# EAGLE schematic EEZ DIB v1.2 module dimensions (EAGLE 7.2.0)
Assembly variants: Farnell, TME
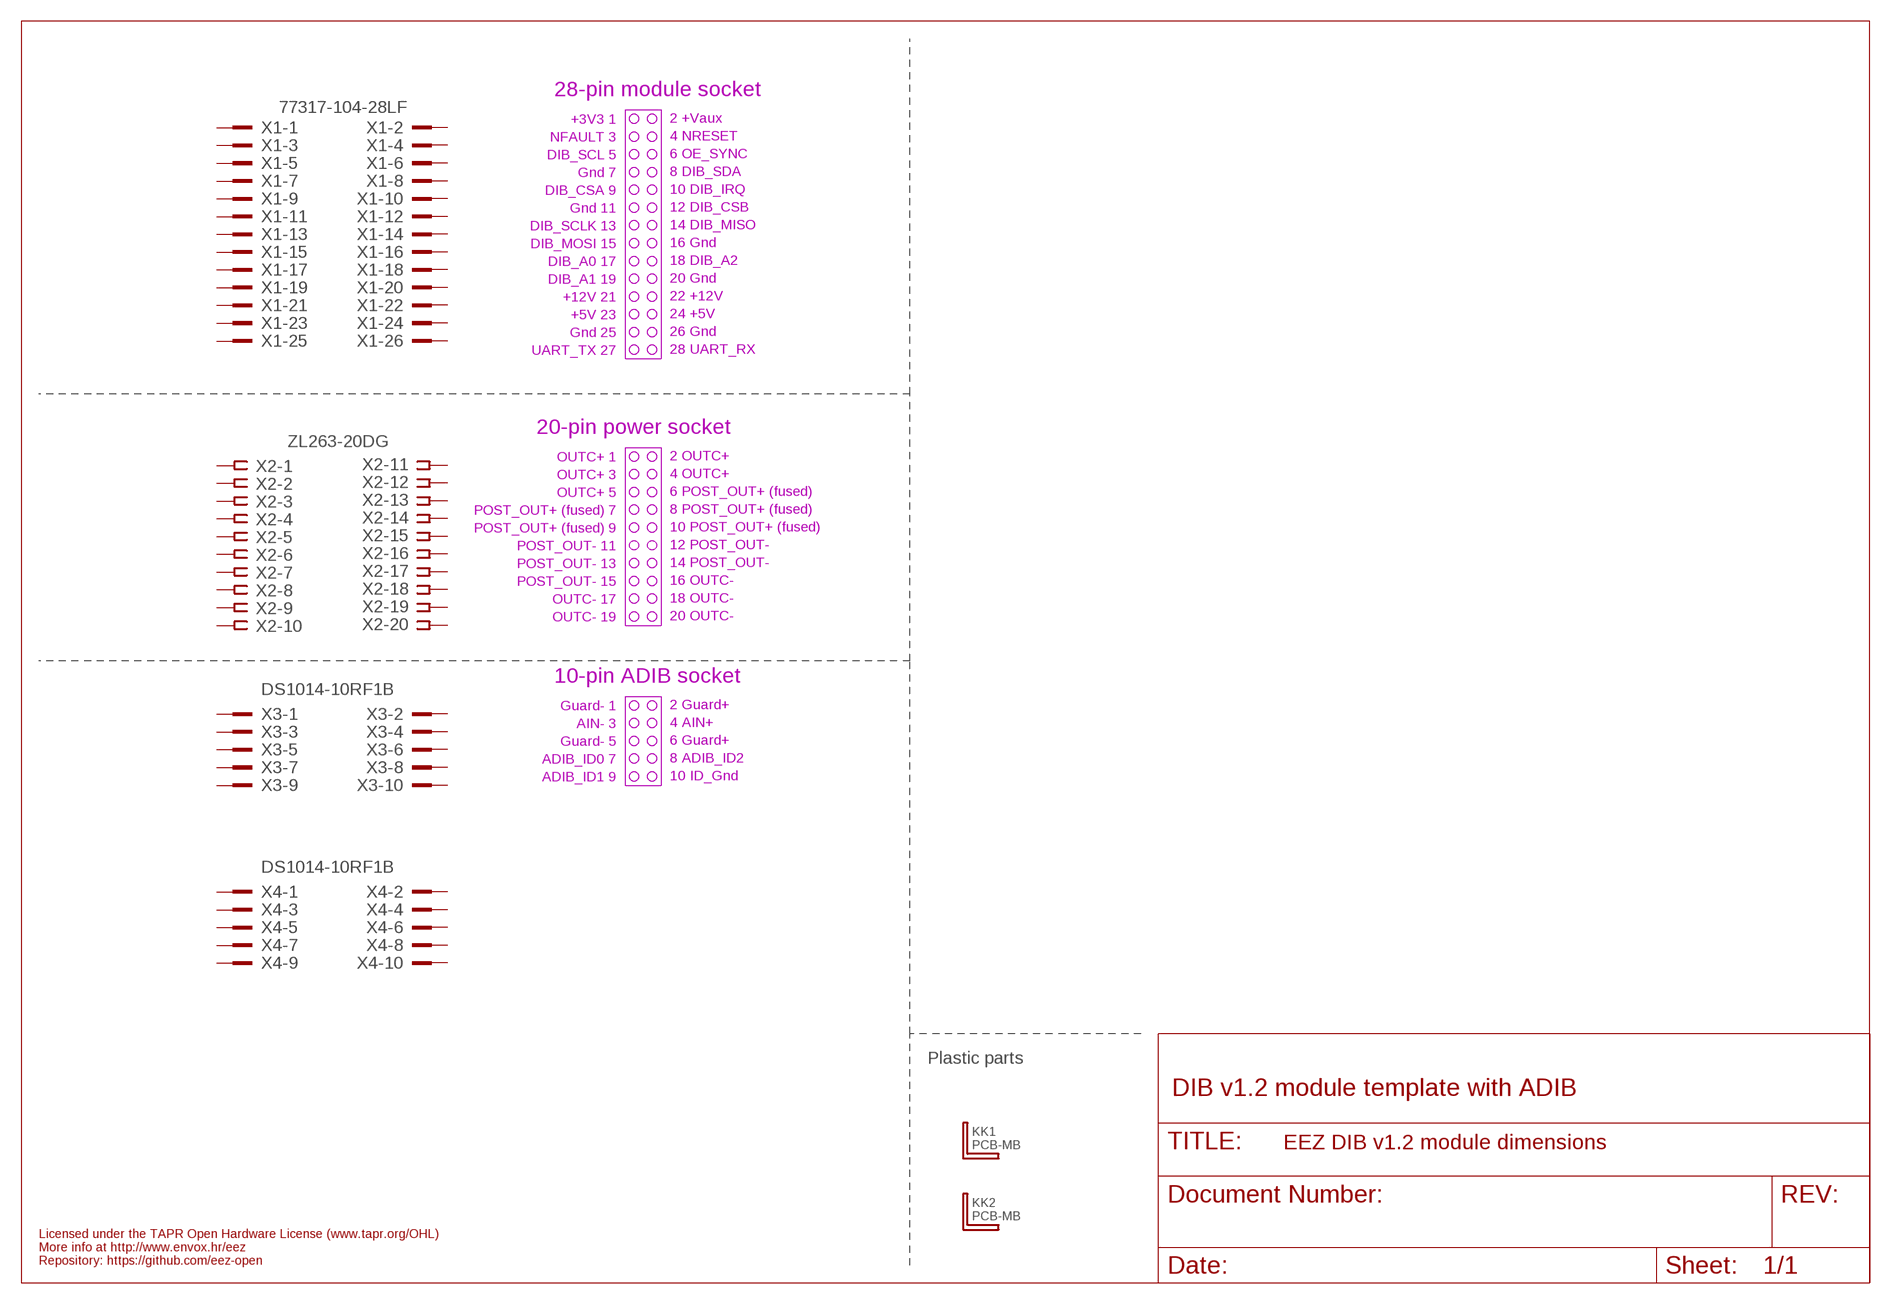
[diagram p0: schematic, sheet 1]

## Parts
KK1  PCB-MB  [PCB-MB]
KK2  PCB-MB  [PCB-MB]
X1  77317-104-28LF  [77317-104-28LF]
X2  ZL263-20DG  SSW-110-02-T-D-RA  [SSW-110-02-T-D-RA]
X3  DS1014-10RF1B  [DS1014-10RF1B]
X4  DS1014-10RF1B  [DS1014-10RF1B]
Unconnected: X1.1 X1.2 X1.3 X1.4 X1.5 X1.6 X1.7 X1.8 X1.9 X1.10 X1.11 X1.12 X1.13 X1.14 X1.15 X1.16 X1.17 X1.18 X1.19 X1.20 X1.21 X1.22 X1.23 X1.24 X1.25 X1.26 X1.27 X1.28 X2.1 X2.2 X2.3 X2.4 X2.5 X2.6 X2.7 X2.8 X2.9 X2.10 X2.11 X2.12 X2.13 X2.14 X2.15 X2.16 X2.17 X2.18 X2.19 X2.20 X3.1 X3.2 X3.3 X3.4 X3.5 X3.6 X3.7 X3.8 X3.9 X3.10 X4.1 X4.2 X4.3 X4.4 X4.5 X4.6 X4.7 X4.8 X4.9 X4.10

## Notes on the sheet
- 28-pin module socket
- +3V3 1
- 2 +Vaux
- NFAULT 3
- 4 NRESET
- DIB_SCL 5
- 6 OE_SYNC
- Gnd 7
- 8 DIB_SDA
- DIB_CSA 9
- 10 DIB_IRQ
- Gnd 11
- 12 DIB_CSB
- DIB_SCLK 13
- 14 DIB_MISO
- DIB_MOSI 15
- 16 Gnd
- DIB_A0 17
- 18 DIB_A2
- DIB_A1 19
- 20 Gnd
- +12V 21
- 22 +12V
- +5V 23
- 24 +5V
- Gnd 25
- 26 Gnd
- UART_TX 27
- 28 UART_RX
- 20-pin power socket
- OUTC+ 1
- 2 OUTC+
- OUTC+ 3
- 4 OUTC+
- OUTC+ 5
- 6 POST_OUT+ (fused)
- POST_OUT+ (fused) 7
- 8 POST_OUT+ (fused)
- POST_OUT+ (fused) 9
- 10 POST_OUT+ (fused)
- POST_OUT- 11
- 12 POST_OUT-
- POST_OUT- 13
- 14 POST_OUT-
- POST_OUT- 15
- 16 OUTC-
- OUTC- 17
- 18 OUTC-
- OUTC- 19
- 20 OUTC-
- 10-pin ADIB socket
- Guard- 1
- 2 Guard+
- AIN- 3
- 4 AIN+
- Guard- 5
- 6 Guard+
- ADIB_ID0 7
- 8 ADIB_ID2
- ADIB_ID1 9
- 10 ID_Gnd
- Plastic parts
- DIB v1.2 module template with ADIB
- Licensed under the TAPR Open Hardware License (www.tapr.org/OHL)
- More info at http://www.envox.hr/eez
- Repository: https://github.com/eez-open

## Library data of the parts
KK1 KK2 = EEZ_Lib1:PCB-MB: Richo Mounting Block; 16 x 6 mm
X1 = EEZ_connectors:77317-104-28LF: Headers & Wire Housings 28P right angle 0.1" pitch
X2 = EEZ_connectors:SSW-110-02-T-D-RA: Samtec SSW-113-02-T-D-RA Receptacle, 2.54MM, RA, 20-way
X3 X4 = EEZ_connectors:DS1014-10RF1B: 10-pin IDC 2mm Socket; male; 90°; THT

## Net classes
0 default: width 0.203 mm, drill 0.3 mm, clearance 0.203 mm
1 lvds: width 0.152 mm, drill 0.3 mm, clearance 0.152 mm to class 0, clearance 0.152 mm
2 gnd: width 0.254 mm, drill 0.584 mm, clearance 0.254 mm